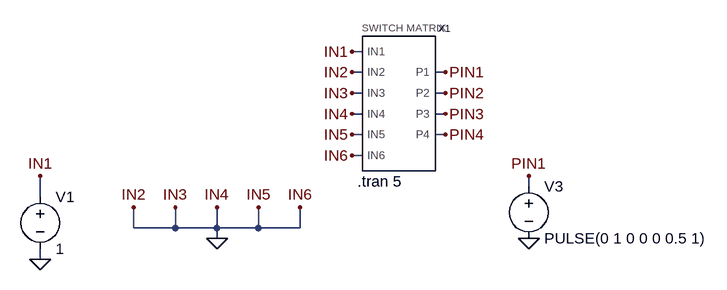
[diagram p0: schematic Circuit2_Part2_SwitchMatrix_Test.asc]
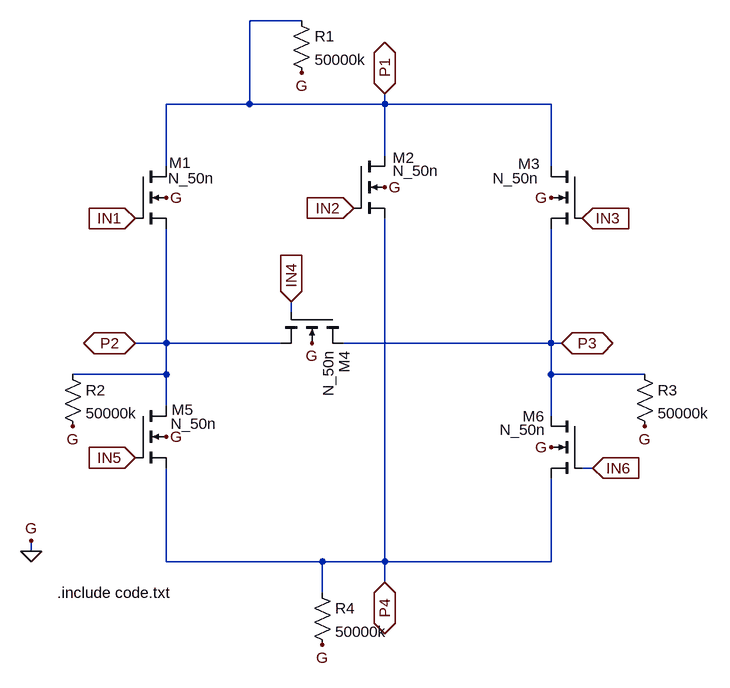
[diagram p1: sub-circuit circuit2_part2_switchmatrix_basic.asc]
Circuit2_Part2_SwitchMatrix_Test.asc, the LTspice schematic file:
Version 4
SHEET 1 880 680
WIRE 160 -32 144 -32
WIRE 160 0 144 0
WIRE 288 0 272 0
WIRE 160 32 144 32
WIRE 288 32 272 32
WIRE 160 64 144 64
WIRE 288 64 272 64
WIRE 160 96 144 96
WIRE 288 96 272 96
WIRE 160 128 144 128
WIRE 416 176 416 160
WIRE -336 192 -336 160
WIRE -192 240 -192 208
WIRE -128 240 -128 208
WIRE -128 240 -192 240
WIRE -64 240 -64 208
WIRE -64 240 -128 240
WIRE 0 240 0 208
WIRE 0 240 -64 240
WIRE 64 240 64 208
WIRE 64 240 0 240
WIRE -64 256 -64 240
WIRE -336 288 -336 272
FLAG -336 288 0
FLAG 416 256 0
FLAG 144 -32 IN1
FLAG 144 0 IN2
FLAG 144 32 IN3
FLAG 144 64 IN4
FLAG 144 96 IN5
FLAG 144 128 IN6
FLAG -192 208 IN2
FLAG -128 208 IN3
FLAG -64 208 IN4
FLAG 0 208 IN5
FLAG 64 208 IN6
FLAG -336 160 IN1
FLAG 288 0 PIN1
FLAG 288 32 PIN2
FLAG 288 64 PIN3
FLAG 288 96 PIN4
FLAG 416 160 PIN1
FLAG -64 256 0
SYMBOL voltage -336 176 R0
WINDOW 123 0 0 Left 0
WINDOW 39 0 0 Left 0
SYMATTR InstName V1
SYMATTR Value 1
SYMBOL voltage 416 160 R0
WINDOW 123 0 0 Left 0
WINDOW 39 0 0 Left 0
SYMATTR InstName V3
SYMATTR Value PULSE(0 1 0 0 0 0.5 1)
SYMBOL Circuit2_Part2_SwitchMatrix_Basic 208 48 R0
SYMATTR InstName X1
TEXT 152 168 Left 2 !.tran 5

circuit2_part2_switchmatrix_basic.asc, the sub-circuit schematic file:
Version 4
SHEET 1 880 680
WIRE 16 -368 -64 -368
WIRE -64 -240 -64 -368
WIRE -64 -240 -192 -240
WIRE 144 -240 144 -256
WIRE 144 -240 -64 -240
WIRE 400 -240 144 -240
WIRE 144 -160 144 -240
WIRE -192 -144 -192 -240
WIRE 400 -144 400 -240
WIRE 0 80 0 64
WIRE -192 128 -192 -48
WIRE -192 128 -240 128
WIRE -16 128 -192 128
WIRE 400 128 400 -48
WIRE 400 128 80 128
WIRE 416 128 400 128
WIRE -192 176 -192 128
WIRE -192 176 -336 176
WIRE 400 176 400 128
WIRE 544 176 400 176
WIRE -192 224 -192 176
WIRE 400 240 400 176
WIRE 464 320 448 320
WIRE -400 448 -400 432
WIRE -192 464 -192 320
WIRE 48 464 -192 464
WIRE 144 464 144 -64
WIRE 144 464 48 464
WIRE 400 464 400 336
WIRE 400 464 144 464
WIRE 144 496 144 464
WIRE 48 512 48 464
FLAG -240 -64 IN1
IOPIN -240 -64 In
FLAG -240 304 IN5
IOPIN -240 304 In
FLAG 464 320 IN6
IOPIN 464 320 In
FLAG 448 -64 IN3
IOPIN 448 -64 In
FLAG 96 -80 IN2
IOPIN 96 -80 In
FLAG 0 64 IN4
IOPIN 0 64 In
FLAG 144 -256 P1
IOPIN 144 -256 BiDir
FLAG -240 128 P2
IOPIN -240 128 BiDir
FLAG 144 496 P4
IOPIN 144 496 BiDir
FLAG 416 128 P3
IOPIN 416 128 BiDir
FLAG 400 -96 G
FLAG 144 -112 G
FLAG -192 -96 G
FLAG 32 128 G
FLAG -192 272 G
FLAG 400 288 G
FLAG -400 432 G
FLAG -400 448 0
FLAG -336 256 G
FLAG 544 256 G
FLAG 16 -288 G
FLAG 48 592 G
SYMBOL nmos4 -240 -144 R0
WINDOW 0 52 -6 Left 2
WINDOW 3 51 18 Left 2
SYMATTR InstName M1
SYMATTR Value N_50n
SYMATTR Value2 l=10u w=1u
SYMBOL nmos4 96 -160 R0
WINDOW 0 60 3 Left 2
WINDOW 3 60 23 Left 2
SYMATTR InstName M2
SYMATTR Value N_50n
SYMATTR Value2 l=10u w=1u
SYMBOL nmos4 448 -144 M0
WINDOW 0 65 -4 Left 2
WINDOW 3 67 18 Left 2
SYMATTR InstName M3
SYMATTR Value N_50n
SYMATTR Value2 l=10u w=1u
SYMBOL nmos4 448 240 M0
WINDOW 0 58 0 Left 2
WINDOW 3 56 21 Left 2
SYMATTR InstName M6
SYMATTR Value N_50n
SYMATTR Value2 l=10u w=1u
SYMBOL nmos4 -240 224 R0
WINDOW 0 56 6 Left 2
WINDOW 3 55 28 Left 2
SYMATTR InstName M5
SYMATTR Value N_50n
SYMATTR Value2 l=10u w=1u
SYMBOL nmos4 80 80 R90
WINDOW 0 60 -2 Left 2
WINDOW 3 59 23 Left 2
SYMATTR InstName M4
SYMATTR Value N_50n
SYMATTR Value2 l=10u w=1u
SYMBOL res 0 -384 R0
SYMATTR InstName R1
SYMATTR Value 50000k
SYMBOL res -352 160 R0
SYMATTR InstName R2
SYMATTR Value 50000k
SYMBOL res 528 160 R0
SYMATTR InstName R3
SYMATTR Value 50000k
SYMBOL res 32 496 R0
SYMATTR InstName R4
SYMATTR Value 50000k
TEXT -360 512 Left 2 !.include code.txt

The netlist it stands for:
* Circuit2_Part2_SwitchMatrix_Test.asc
V1 IN1 0 1
V3 PIN1 0 PULSE(0 1 0 0 0 0.5 1)
XX1 IN1 0 0 0 0 0 PIN1 PIN2 PIN3 PIN4 circuit2_part2_switchmatrix_basic

* block symbol definitions
.subckt circuit2_part2_switchmatrix_basic IN1 IN2 IN3 IN4 IN5 IN6 P1 P2 P3 P4
M1 P1 IN1 P2 0 N_50n l=10u w=1u
M2 P1 IN2 P4 0 N_50n l=10u w=1u
M3 P1 IN3 P3 0 N_50n l=10u w=1u
M6 P3 IN6 P4 0 N_50n l=10u w=1u
M5 P2 IN5 P4 0 N_50n l=10u w=1u
M4 P3 IN4 P2 0 N_50n l=10u w=1u
R1 P1 0 50000k
R2 P2 0 50000k
R3 P3 0 50000k
R4 P4 0 50000k
.include code.txt
.ends circuit2_part2_switchmatrix_basic

.model NMOS NMOS
.model PMOS PMOS
.lib standard.mos
.tran 5
.backanno
.end